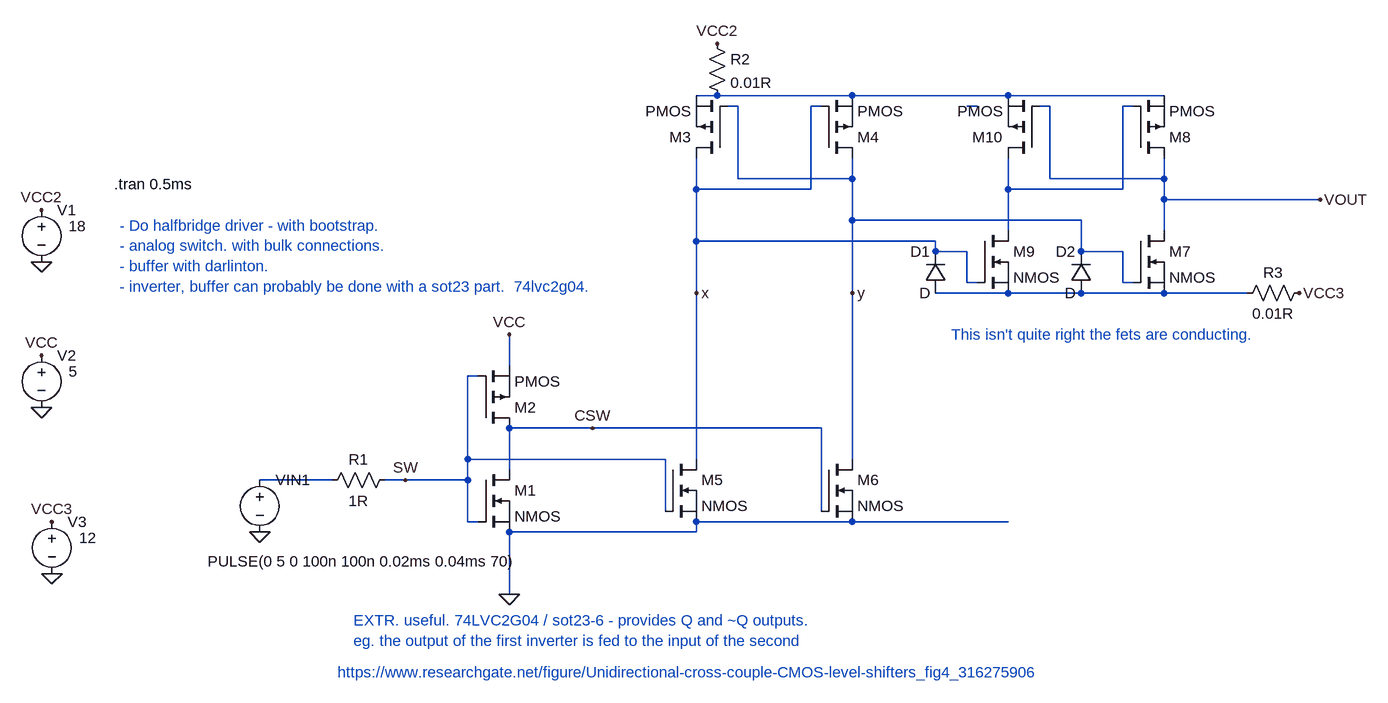
[diagram p0: schematic Draft63.asc]
Draft63.asc, the LTspice schematic file:
Version 4
SHEET 1 2756 1020
WIRE 1024 -256 992 -256
WIRE 1232 -256 1024 -256
WIRE 1472 -256 1232 -256
WIRE 1712 -256 1472 -256
WIRE 1056 -240 1040 -240
WIRE 1184 -240 1168 -240
WIRE 1424 -240 1408 -240
WIRE 1536 -240 1520 -240
WIRE 1664 -240 1648 -240
WIRE 1488 -176 1472 -176
WIRE 1056 -128 1056 -240
WIRE 1232 -128 1232 -160
WIRE 1232 -128 1056 -128
WIRE 1536 -128 1536 -240
WIRE 1712 -128 1712 -160
WIRE 1712 -128 1536 -128
WIRE 992 -112 992 -160
WIRE 1168 -112 1168 -240
WIRE 1168 -112 992 -112
WIRE 1472 -112 1472 -160
WIRE 1648 -112 1648 -240
WIRE 1648 -112 1472 -112
WIRE 1712 -96 1712 -128
WIRE 1952 -96 1712 -96
WIRE 1232 -64 1232 -128
WIRE 1584 -64 1232 -64
WIRE 1472 -48 1472 -112
WIRE 1712 -48 1712 -96
WIRE 992 -32 992 -112
WIRE 1360 -32 992 -32
WIRE 1360 -16 1360 -32
WIRE 1408 -16 1360 -16
WIRE 1584 -16 1584 -64
WIRE 1648 -16 1584 -16
WIRE 1408 32 1408 -16
WIRE 1424 32 1408 32
WIRE 1648 32 1648 -16
WIRE 1664 32 1648 32
WIRE 992 48 992 -32
WIRE 1232 48 1232 -64
WIRE 1472 48 1360 48
WIRE 1584 48 1472 48
WIRE 1712 48 1584 48
WIRE 1840 48 1712 48
WIRE 704 160 704 112
WIRE 656 176 640 176
WIRE 832 256 704 256
WIRE 1184 256 832 256
WIRE 640 304 640 176
WIRE 944 304 640 304
WIRE 992 304 992 48
WIRE 1232 304 1232 48
WIRE 704 320 704 256
WIRE 432 336 320 336
WIRE 544 336 512 336
WIRE 640 336 640 304
WIRE 640 336 544 336
WIRE 944 384 944 304
WIRE 1184 384 1184 256
WIRE 640 400 640 336
WIRE 656 400 640 400
WIRE 1232 400 992 400
WIRE 1472 400 1232 400
WIRE 992 416 992 400
WIRE 992 416 704 416
WIRE 704 512 704 416
FLAG -16 0 0
FLAG -16 -80 VCC2
FLAG 544 336 SW
FLAG 320 416 0
FLAG 832 256 CSW
FLAG 704 512 0
FLAG -16 224 0
FLAG -16 144 VCC
FLAG 704 112 VCC
FLAG 1024 -336 VCC2
FLAG 992 48 x
FLAG 1232 48 y
FLAG 0 480 0
FLAG 0 400 VCC3
FLAG 1920 48 VCC3
FLAG 1952 -96 VOUT
SYMBOL voltage -16 -96 R0
WINDOW 123 0 0 Left 0
WINDOW 39 0 0 Left 0
WINDOW 3 42 41 Left 2
SYMATTR Value 18
SYMATTR InstName V1
SYMBOL voltage 320 320 R0
WINDOW 123 0 0 Left 0
WINDOW 39 0 0 Left 0
WINDOW 3 -80 141 Left 2
SYMATTR Value PULSE(0 5 0 100n 100n 0.02ms 0.04ms 70)
SYMATTR InstName VIN1
SYMBOL nmos 656 320 R0
SYMATTR InstName M1
SYMBOL pmos 656 256 M180
SYMATTR InstName M2
SYMBOL voltage -16 128 R0
WINDOW 123 0 0 Left 0
WINDOW 39 0 0 Left 0
WINDOW 3 42 41 Left 2
SYMATTR Value 5
SYMATTR InstName V2
SYMBOL nmos 944 304 R0
SYMATTR InstName M5
SYMBOL nmos 1184 304 R0
SYMATTR InstName M6
SYMBOL res 528 320 R90
WINDOW 0 0 56 VBottom 2
WINDOW 3 32 56 VTop 2
SYMATTR InstName R1
SYMATTR Value 1R
SYMBOL pmos 1040 -160 R180
SYMATTR InstName M3
SYMBOL pmos 1184 -160 M180
SYMATTR InstName M4
SYMBOL nmos 1664 -48 R0
SYMATTR InstName M7
SYMBOL pmos 1664 -160 M180
SYMATTR InstName M8
SYMBOL voltage 0 384 R0
WINDOW 123 0 0 Left 0
WINDOW 39 0 0 Left 0
WINDOW 3 42 41 Left 2
SYMATTR Value 12
SYMATTR InstName V3
SYMBOL diode 1376 48 R180
WINDOW 0 24 64 Left 2
WINDOW 3 24 0 Left 2
SYMATTR InstName D1
SYMBOL nmos 1424 -48 R0
SYMATTR InstName M9
SYMBOL pmos 1520 -160 R180
SYMATTR InstName M10
SYMBOL diode 1600 48 R180
WINDOW 0 24 64 Left 2
WINDOW 3 24 0 Left 2
SYMATTR InstName D2
SYMBOL res 1008 -352 R0
SYMATTR InstName R2
SYMATTR Value 0.01R
SYMBOL res 1936 32 R90
WINDOW 0 0 56 VBottom 2
WINDOW 3 32 56 VTop 2
SYMATTR InstName R3
SYMATTR Value 0.01R
TEXT 96 -120 Left 2 !.tran 0.5ms
TEXT 440 632 Left 2 ;https://www.researchgate.net/figure/Unidirectional-cross-couple-CMOS-level-shifters_fig4_316275906
TEXT 104 -56 Left 2 ;- Do halfbridge driver - with bootstrap.\n- analog switch. with bulk connections.\n- buffer with darlinton.\n- inverter, buffer can probably be done with a sot23 part.  74lvc2g04.
TEXT 464 552 Left 2 ;EXTR. useful. 74LVC2G04 / sot23-6 - provides Q and ~Q outputs.  \neg. the output of the first inverter is fed to the input of the second
TEXT 1384 112 Left 2 ;This isn't quite right the fets are conducting.

The netlist it stands for:
* Draft63.asc
V1 VCC2 0 18
VIN1 N006 0 PULSE(0 5 0 100n 100n 0.02ms 0.04ms 70)
M1 CSW SW 0 0 NMOS
M2 CSW SW VCC VCC PMOS
V2 VCC 0 5
M5 x SW 0 0 NMOS
M6 y CSW 0 0 NMOS
R1 SW N006 1R
M3 x y N001 N001 PMOS
M4 y x N001 N001 PMOS
M7 VOUT y N005 N005 NMOS
M8 VOUT N003 N001 N001 PMOS
V3 VCC3 0 12
D1 N005 x D
M9 N003 x N005 N005 NMOS
M10 N003 VOUT N001 N001 PMOS
D2 N005 y D
R2 VCC2 N001 0.01R
R3 VCC3 N005 0.01R
.model D D
.lib standard.dio
.model NMOS NMOS
.model PMOS PMOS
.lib standard.mos
.tran 0.5ms
* https://www.researchgate.net/figure/Unidirectional-cross-couple-CMOS-level-shifters_fig4_316275906
* - Do halfbridge driver - with bootstrap.
* - analog switch. with bulk connections.
* - buffer with darlinton.
* - inverter, buffer can probably be done with a sot23 part.  74lvc2g04.
* EXTR. useful. 74LVC2G04 / sot23-6 - provides Q and ~Q outputs.
* eg. the output of the first inverter is fed to the input of the second
* This isn't quite right the fets are conducting.
.backanno
.end